# EAGLE design rev6_eagle7 (EAGLE 7.7.0)
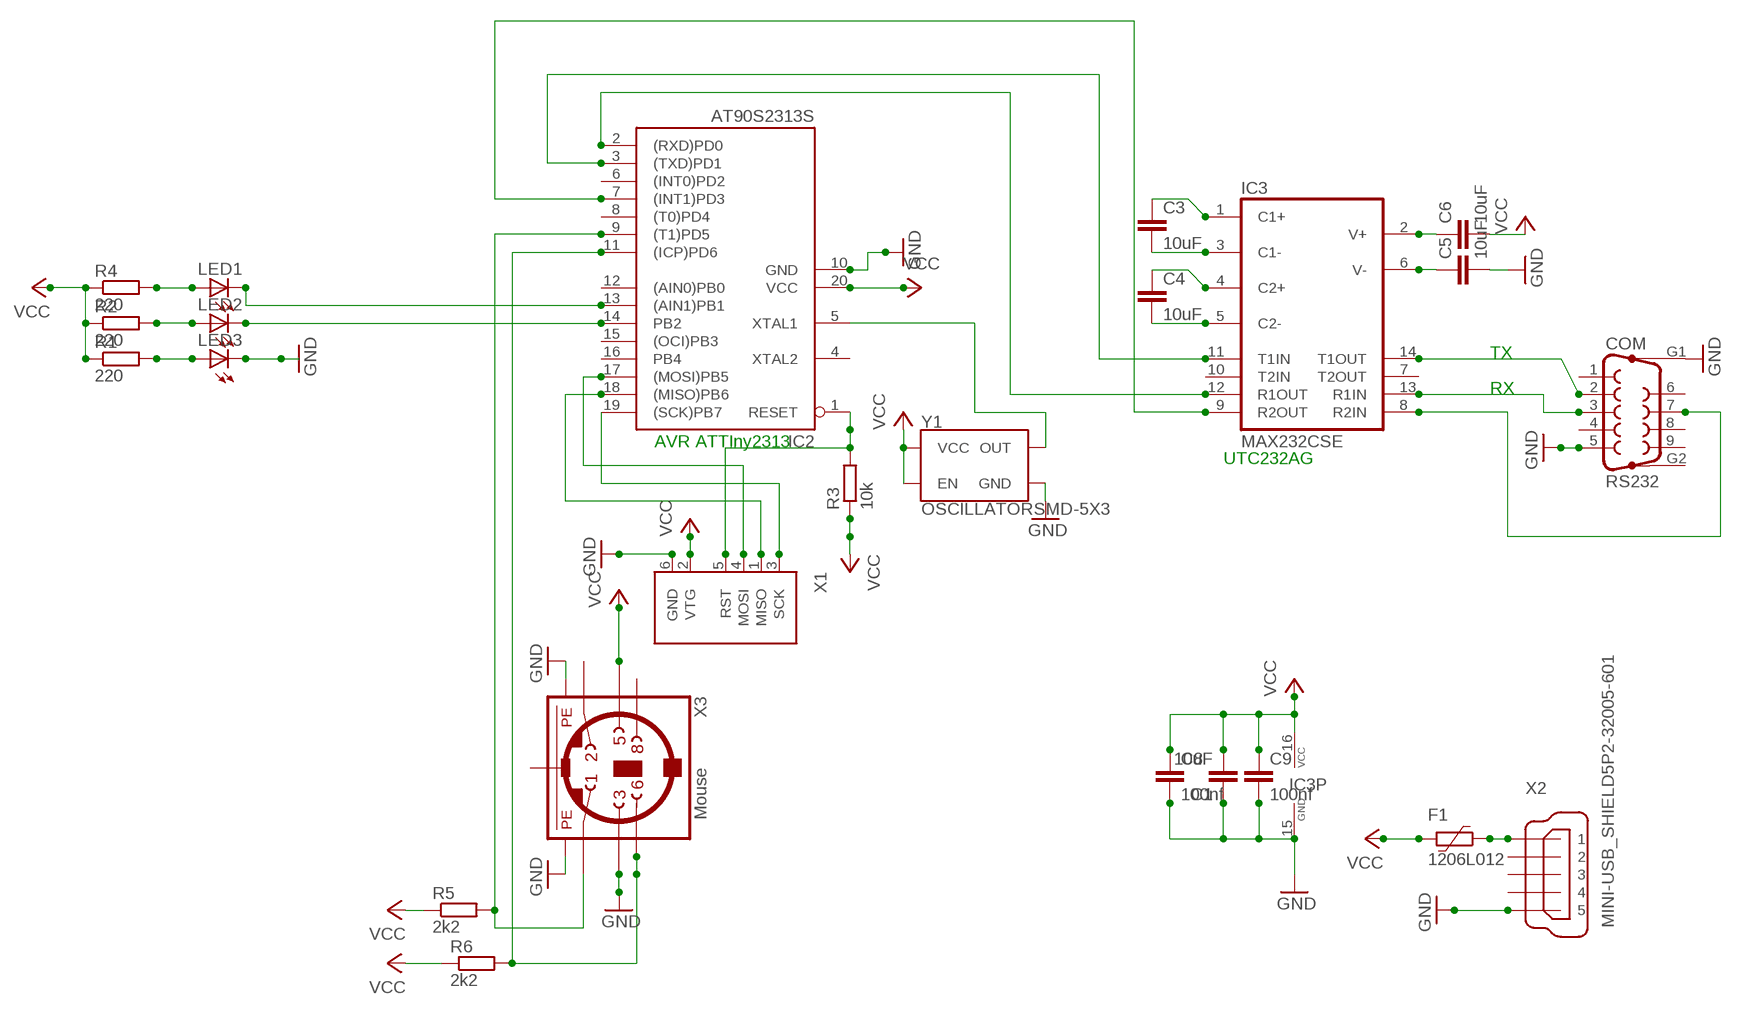
[diagram p0: schematic, sheet 1]

## Parts
C1  10uF  10UF-0805-25V-10%  [0805]
C3  10uF  10UF-0805-25V-10%  [0805]
C4  10uF  10UF-0805-25V-10%  [0805]
C5  10uF  10UF-0805-25V-10%  [0805]
C6  10uF  10UF-0805-25V-10%  [0805]
C8  100nf  C-EUC0805K  [C0805K]
C9  100nf  C-EUC0805K  [C0805K]
COM  RS232  F09HP  [F09HP]
F1  1206L012  [1206L]
IC2  AT90S2313S  [SO20L]
IC3  MAX232CSE  [SO16]
LED1  LEDCHIPLED_0805  [CHIPLED_0805]
LED2  LEDCHIPLED_0805  [CHIPLED_0805]
LED3  LEDCHIPLED_0805  [CHIPLED_0805]
R1  220  R-EU_R0805  [R0805]
R2  220  R-EU_R0805  [R0805]
R3  10k  R-EU_R1206  [R1206]
R4  220  R-EU_R0805  [R0805]
R5  2k2  R-EU_R1206  [R1206]
R6  2k2  R-EU_R1206  [R1206]
X1  AVRISP6PINHEADER  [6PINHEADER]
X2  MINI-USB_SHIELD5P2-32005-601  [32005-601]
X3  Mouse  MINI_DIN_6  [M_DIN6]
Y1  OSCILLATORSMD-5X3  [OSCILLATOR-SMD-5X3.2]

## Nets
GND: C1.1 C5.2 C8.2 C9.2 COM.5 COM.G1 IC2.10(GND) IC3.15(GND) LED3.C X1.6(GND) X2.5 X3.3 X3.SH1(PE1) X3.SH3(PE3) Y1.2(GND)
N$1: IC2.3((TXD)PD1) IC3.11(T1IN)
N$2: IC2.2((RXD)PD0) IC3.12(R1OUT)
N$3: C3.2 IC3.3(C1-)
N$4: C3.1 IC3.1(C1+)
N$5: C4.1 IC3.4(C2+)
N$6: C4.2 IC3.5(C2-)
N$7: IC2.1(RESET) R3.2 X1.5(RST)
N$8: IC2.11((ICP)PD6) R6.2 X3.6
N$9: COM.2 IC3.14(T1OUT)
N$10: LED3.A R1.2
N$11: IC2.7((INT1)PD3) IC3.9(R2OUT)
N$12: IC2.5(XTAL1) Y1.3(OUT)
N$13: IC2.14(PB2) LED2.C
N$14: C5.1 IC3.6(V-)
N$15: C6.1 IC3.2(V+)
N$16: IC2.13((AIN1)PB1) LED1.C
N$17: COM.3 IC3.13(R1IN)
N$20: LED2.A R2.2
N$21: LED1.A R4.2
N$22: IC2.9((T1)PD5) R5.2 X3.1
N$26 [VCC]: F1.1 X2.1
PB5: IC2.17((MOSI)PB5) X1.4(MOSI)
PB6: IC2.18((MISO)PB6) X1.1(MISO)
PB7: IC2.19((SCK)PB7) X1.3(SCK)
SERIAL#: COM.7 IC3.8(R2IN)
VCC [VCC]: C1.2 C6.2 C8.1 C9.1 F1.2 IC2.20(VCC) IC3.16(VCC) R1.1 R2.1 R3.1 R4.1 R5.1 R6.1 X1.2(VTG) X3.5 Y1.1(EN) Y1.4(VCC)
Unconnected: COM.1 COM.4 COM.6 COM.8 COM.9 COM.G2 IC2.4(XTAL2) IC2.6((INT0)PD2) IC2.8((T0)PD4) IC2.12((AIN0)PB0) IC2.15((OCI)PB3) IC2.16(PB4) IC3.7(T2OUT) IC3.10(T2IN) X2.2 X2.3 X2.4 X2.M1(S1) X2.M2(S2) X3.2 X3.8

## Notes on the sheet
- TX
- RX
- AVR ATTIny2313
- UTC232AG

## Power pins joined to a net without a drawn wire
PE2: X3.SH2(PE2)

## Library data of the parts
C1 C3-C6 = SparkFun-Capacitors:10UF: 10.0µF ceramic capacitors A capacitor is a passive two-terminal electrical component used to store electrical energy temporarily in an electric field.; PROD_ID: CAP-14259
C8 C9 = rcl@1:C-EU: CAPACITOR, European symbol; SPICEPREFIX: C
COM = con-subd:F09HP: SUB-D; OC_FARNELL: unknown; OC_NEWARK: unknown
F1 = polyfuse-smd_10:?: Polyfuse Resettable PTC Source: http://www.littelfuse.com/products/resettable-ptcs.aspx; MF: Littelfuse; MPN: 1206L012; OC_FARNELL: 1596988; OC_NEWARK: 05M2298
IC2 = atmel:AT90S2313: MICROCONTROLLER 2 Kbytes FLASH 128 bytes SRAM 128 bytes EEPROM UART; OC_FARNELL: unknown; OC_NEWARK: unknown
IC3 = maxim-8:MAX232*: RS232 TRANSEIVER
LED1-LED3 = led:LED: LED OSRAM: - CHIPLED LG R971, LG N971, LY N971, LG Q971, LY Q971, LO R971, LY R971 LH N974, LH R974 LS Q976, LO Q976, LY Q976 LO Q996 - Hyper CHIPLED LW Q18S LB Q993, LB Q99A, LB R99A - SideLED LS A670, LO A670, LY A670, LG A670, LP A670 LB A673, LV A673, LT A673, LW A673 LH A674 LY A675 LS A676, LA A676, LO A676, LY A676, LW A676 LS A679, LY A679, LG A679 - Hyper Micro SIDELED® LS Y876, LA Y876, LO Y876, LY Y876 LT Y87S - SmartLED LW L88C, LW L88S LB L89C, LB L89S, LG L890 LS L89K, LO L89K, LY L89K LS L896, LA L896, LO L896, LY L896 - TOPLED LS T670, LO T670, LY T670, LG T670, LP T670 LSG T670, LSP T670, LSY T670, LOP T670, LYG T670 LG T671, LOG T671, LSG T671 LB T673, LV T673, LT T673, LW T673 LH T674 LS T676, LA T676, LO T676, LY T676, LB T676, LH T676, LSB T676, LW T676 LB T67C, LV T67C, LT T67C, LS T67K, LO T67K, LY T67K, LW E67C LS E67B, LA E67B, LO E67B, LY E67B, LB E67C, LV E67C, LT E67C LW T67C LS T679, LY T679, LG T679 LS T770, LO T770, LY T770, LG T770, LP T770 LB T773, LV T773, LT T773, LW T773 LH T774 LS E675, LA E675, LY E675, LS T675 LS T776, LA T776, LO T776, LY T776, LB T776 LHGB T686 LT T68C, LB T68C - Hyper Mini TOPLED® LB M676 - Mini TOPLED Santana® LG M470 LS M47K, LO M47K, LY M47K Source: http://www.osram.convergy.de LUXEON: - LUMILED® LXK2-PW12-R00, LXK2-PW12-S00, LXK2-PW14-U00, LXK2-PW14-V00 LXK2-PM12-R00, LXK2-PM12-S00, LXK2-PM14-U00 LXK2-PE12-Q00, LXK2-PE12-R00, LXK2-PE12-S00, LXK2-PE14-T00, LXK2-PE14-U00 LXK2-PB12-K00, LXK2-PB12-L00, LXK2-PB12-M00, LXK2-PB14-N00, LXK2-PB14-P00, LXK2-PB14-Q00 LXK2-PR12-L00, LXK2-PR12-M00, LXK2-PR14-Q00, LXK2-PR14-R00 LXK2-PD12-Q00, LXK2-PD12-R00, LXK2-PD12-S00 LXK2-PH12-R00, LXK2-PH12-S00 LXK2-PL12-P00, LXK2-PL12-Q00, LXK2-PL12-R00 Source: www.luxeon.com KINGBRIGHT: KA-3528ASYC Source: www.kingbright.com
R1 R2 R4 = rcl@1:R-EU_: RESISTOR, European symbol; SPICEPREFIX: R
R3 R5 R6 = rcl:R-EU_: RESISTOR, European symbol
X1 = avrisp:AVRISP6PIN
X2 = con-cypressindustries:MINI-USB_SHIELD5P2-: MINI USB-B R/A DIP 5pol. Source: www.cypressindustries.com; OC_FARNELL: unknown; OC_NEWARK: unknown
X3 = mini_din:MINI_DIN_6
Y1 = SparkFun-Clocks:OSCILLATOR: Oscillators (Generic) These are active oscillators, which require a power source to generate their clock output. Most oscillators are configured to generate a set frequency (e.g. 16MHz). They have four pins: power, ground, output, and an enable input.

## Net classes
1 VCC: width 0.006 mm

## Board
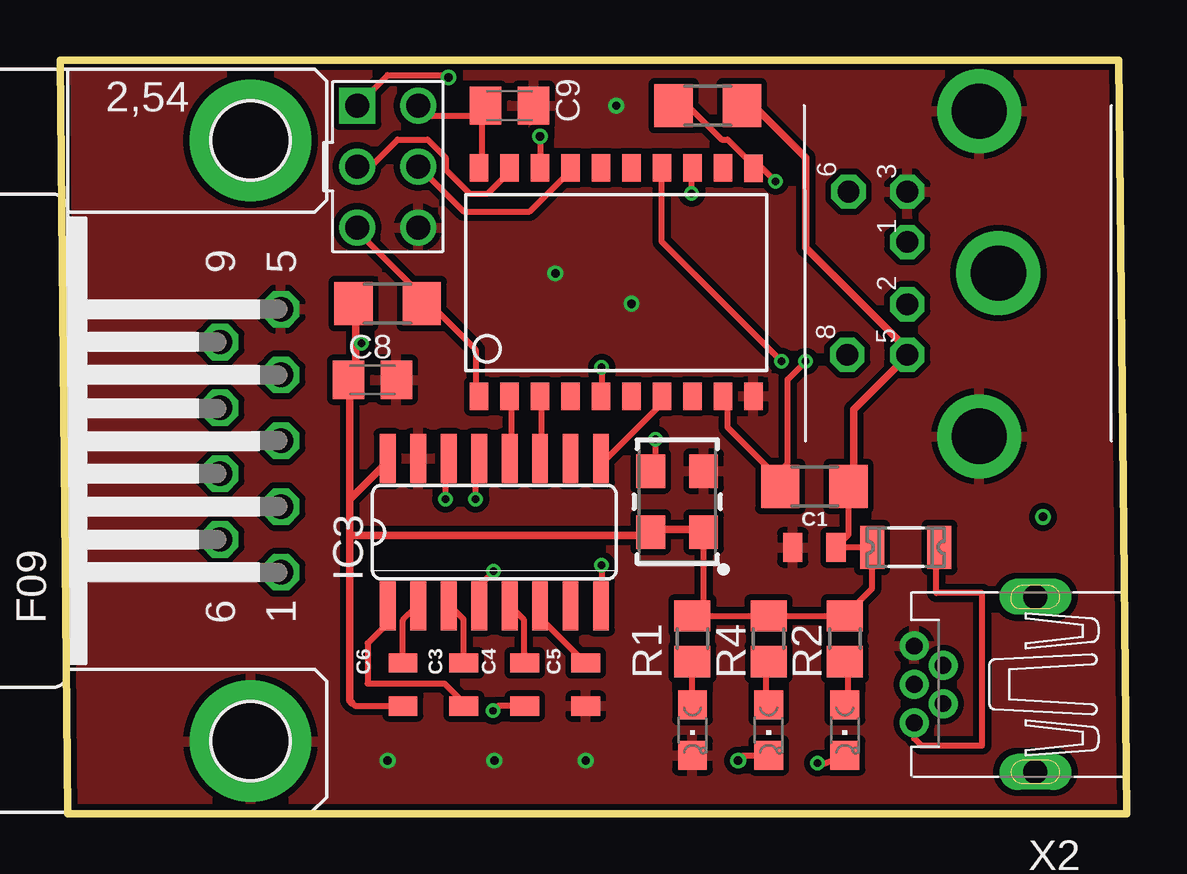
[diagram p1: board, top side]
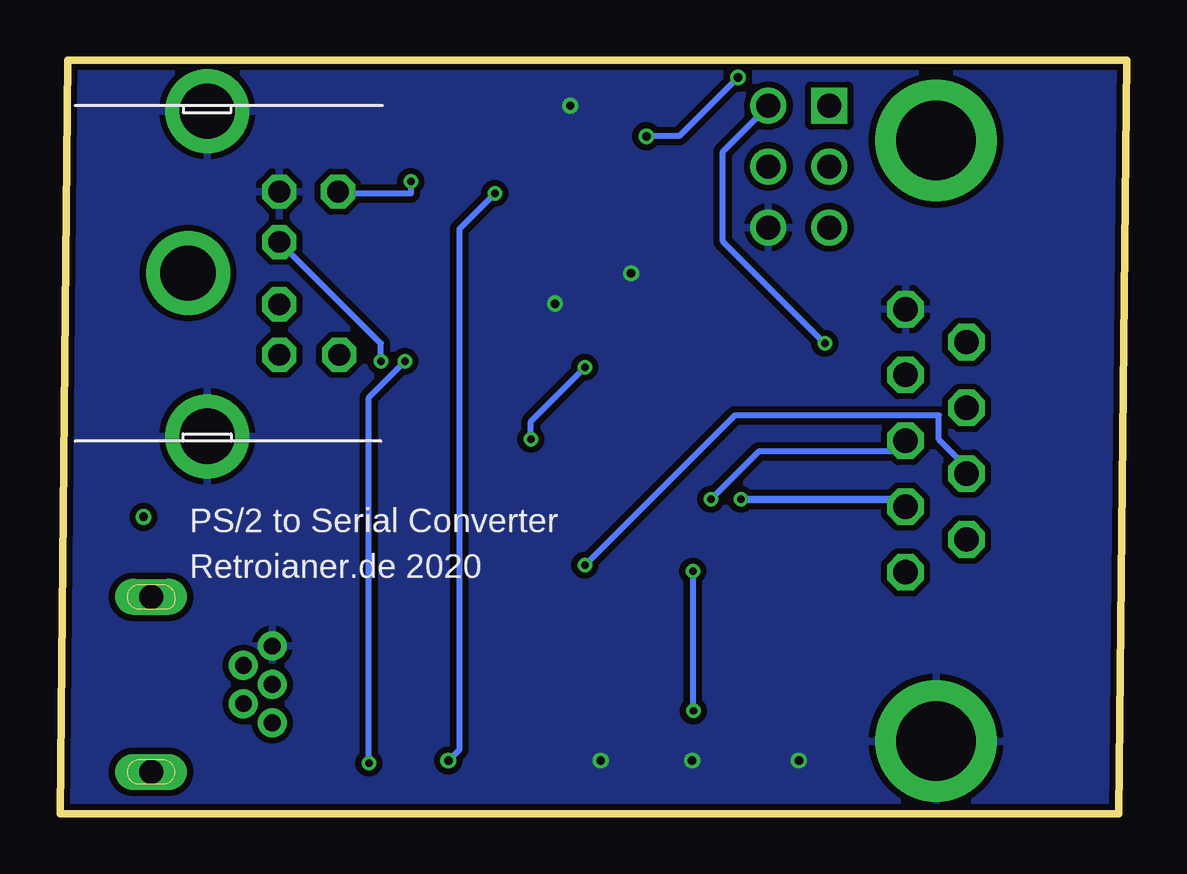
[diagram p2: board, bottom side, seen from below]

Size 44.44 x 31.43 mm. Coordinates in mm from the lower left corner, seen from the top.
Outline: 0.32,0 44.44,0 44.12,31.43 0,31.43 0.32,0
Copper layers (1*16): Top 0.035mm / dielectric 1.5mm / Bottom 0.035mm
Design rules "dirt_cheap_dirty_boards.v1.1 *": minimum track width 10mil, minimum drill 12mil, track to track 6mil, track to pad 6mil, pad to pad 6mil, via to via 6mil, smd to smd 0mil, copper to edge 10mil, drill to drill 10mil, minimum pad ring 10mil, minimum via ring 6mil, stop-mask expansion 2mil, vias tented up to drill 25mil, thermal gap 10mil

### Footprints (pad centres in the part's own frame; a part is rotated, then mirrored left to right if it is on the bottom)
0805 = smd 0.8 x 1.2: 1 -0.9,0; 2 0.9,0
C0805K = smd 1.3 x 1.6: 1 -1,0; 2 1,0
F09HP = drill 1.016 octagon: 1 -5.486,-1.27; 2 -2.743,-1.27; 3 0,-1.27; 4 2.743,-1.27; 5 5.486,-1.27; 6 -4.115,1.27; 7 -1.372,1.27; 8 1.372,1.27; 9 4.115,1.27 | drill 3.302 pad 5.08: G1 -12.522,0; G2 12.522,0
1206L = smd 1 x 1.8: 1 -1.4,0; 2 1.4,0
SO20L = smd 0.762 x 1.143: 1 -5.08,-5.131; 2 -3.81,-5.131; 3 -2.54,-5.131; 4 -1.27,-5.131; 5 0,-5.131; 6 1.27,-5.131; 7 2.54,-5.131; 8 3.81,-5.131; 9 5.08,-5.131; 10 6.35,-5.131; 11 6.35,4.369; 12 5.08,4.394; 13 3.81,4.394; 14 2.54,4.394; 15 1.27,4.394; 16 0,4.394; 17 -1.27,4.394; 18 -2.54,4.394; 19 -3.81,4.394; 20 -5.08,4.394
SO16 = smd 0.66 x 2.032: 1 -4.445,-3.073; 2 -3.175,-3.073; 3 -1.905,-3.073; 4 -0.635,-3.073; 5 0.635,-3.073; 6 1.905,-3.073; 7 3.175,-3.073; 8 4.445,-3.073; 9 4.445,3.073; 10 3.175,3.073; 11 1.905,3.073; 12 0.635,3.073; 13 -0.635,3.073; 14 -1.905,3.073; 15 -3.175,3.073; 16 -4.445,3.073
CHIPLED_0805 = smd 1.2 x 1.2: A 0,-1.05; C 0,1.05
R0805 = smd 1.3 x 1.5: 1 -0.95,0; 2 0.95,0
R1206 = smd 1.6 x 1.803: 1 -1.422,0; 2 1.422,0
6PINHEADER = drill 1 square: 1 -1.27,2.54 | drill 1: 2 1.27,2.54; 3 -1.27,0; 4 1.27,0; 5 -1.27,-2.54; 6 1.27,-2.54
32005-601 = drill 0.7 pad 1.016: 1 2.825,1.6; 2 1.625,0.8; 3 2.825,0; 4 1.625,-0.8; 5 2.825,-1.6 | drill 1 pad 1.422 long: M1 -2.225,3.65; M2 -2.225,-3.65
M_DIN6 = drill 0.9 pad 1.422 octagon: 1 -1.3,-3.75; 2 1.3,-3.75; 3 -3.4,-3.75; 5 3.4,-3.75; 6 -3.4,-6.2; 8 3.4,-6.25 | drill 2.3 pad 3.5: SH1 6.8,-0.75; SH2 0,0.05; SH3 -6.75,-0.75
OSCILLATOR-SMD-5X3.2 = smd 1.397 x 1.194: 1 -1.27,-1.1; 2 1.27,-1.1; 3 1.27,1.1; 4 -1.27,1.1

### Placement (x,y rotation side)
C1  31.43,11.11 0 top
C3  16.83,5.4 90 top
C4  19.37,5.4 90 top
C5  21.91,5.4 270 top
C6  14.29,5.4 270 top
C8  13.02,18.1 0 top
C9  18.73,29.53 0 top
COM  7.94,15.56 90 top
F1  35.24,11.11 180 top
IC2  22.54,22.54 0 top
IC3  18.1,11.75 0 top
LED1  29.53,3.49 180 top
LED2  32.7,3.49 180 top
LED3  26.35,3.49 180 top
R1  26.35,7.3 270 top
R2  32.7,7.3 270 top
R3  13.65,21.27 0 top
R4  29.53,7.3 270 top
R5  31.43,13.65 180 top
R6  26.99,29.53 180 top
X1  13.65,26.99 0 top
X2  38.42,5.4 180 top
X3  39.05,22.54 270 top
Y1  25.72,13.02 90 top

### Tracks (layer width: path | path; a pad name or v marks a point on that pad's centre or on a via)
GND  (via drill 0.35)
  other vias: 13.65,2.22 18.1,2.22 21.91,2.22 20.64,22.54 23.81,21.27 23.18,29.53
  pour Bottom (isolate 0.254): 0.32,31.43 44.13,31.43 44.13,0 0.32,0
  pour Top (isolate 0.254): 0.32,31.43 0.32,0 44.13,0 44.13,31.43
N$1
  Top 0.254: IC2.3 20.07,17.37 20.07,14.87 IC3.11
N$2
  Top 0.254: IC2.2 18.82,17.37 18.82,14.87 IC3.12
N$3
  Top 0.254: IC3.3 16.32,8.62 16.82,8.12 C3.2
N$4
  Top 0.254: IC3.1 13.57,8.62 13.57,7.87 12.82,7.12 12.82,5.43 16.02,5.43 16.6,4.85 16.6,4.72 C3.1
N$5  (via drill 0.3)
  Top 0.254: v18.07,10.12 17.57,9.62 17.57,8.87 IC3.4 | C4.1 18.24,4.5 v18.05,4.3
  Bottom 0.254: v18.05,4.3 18.07,4.32 v18.07,10.12
N$6
  Top 0.254: IC3.5 18.82,8.62 19.32,8.12 19.32,6.67 19.37,6.67 C4.2
N$7
  Top 0.254: 15.32,21.37 17.32,19.37 17.32,17.62 IC2.1 | 15.32,21.37 12.57,24.12 12.57,24.37 X1.5 | 15.32,21.37 R3.2
N$8  (via drill 0.3)
  Top 0.254: R6.2 25.57,29.37 26.32,29.37 27.57,28.12 27.82,28.12 28.82,27.12 IC2.11 29.07,27.12 v29.82,26.37
  Bottom 0.254: v29.82,26.37 29.82,25.87 32.82,25.87 X3.6
N$9  (via drill 0.3)
  Top 0.254: v16.07,13.12 16.07,14.62 IC3.14
  Bottom 0.254: 9.32,13.12 9.32,12.87 COM.2
  Bottom 0.305: 9.32,13.12 v16.07,13.12
N$10
  Top 0.254: LED3.A R1.2
N$11
  Top 0.254: IC2.7 25.07,17.37 25.07,17.12 22.57,14.62 IC3.9
N$12  (via drill 0.3)
  Top 0.254: v22.57,18.62 22.57,17.62 IC2.5 | v24.82,15.62 24.82,14.37 Y1.3
  Bottom 0.254: v22.57,18.62 24.82,16.37 v24.82,15.62
N$13  (via drill 0.3)
  Top 0.254: v30.07,18.87 25.07,23.87 25.07,26.87 IC2.14 | v31.57,2.12 31.67,2.02 LED2.C
  Bottom 0.254: v30.07,18.87 31.57,17.37 v31.57,2.12
N$14
  Top 0.254: IC3.6 20.07,8.62 20.07,8.12 21.82,6.37 21.84,6.37 C5.1
N$15
  Top 0.254: IC3.2 14.82,8.62 14.29,8.09 C6.1
N$16  (via drill 0.3, 0.35)
  Top 0.254: v26.32,25.87 26.32,26.87 IC2.13 | v28.26,2.22 28.48,2.44 LED1.C
  Bottom 0.254: v26.32,25.87 27.8,24.39 27.8,2.68 v28.26,2.22
N$17  (via drill 0.3)
  Top 0.254: v17.32,13.12 17.32,14.62 IC3.13
  Bottom 0.254: v17.32,13.12 15.32,15.12 9.32,15.12 9.32,15.37 COM.3
N$20
  Top 0.254: LED2.A 32.82,4.64 32.82,6.24 R2.2
N$21
  Top 0.254: LED1.A 29.43,4.64 29.43,6.26 R4.2
N$22  (via drill 0.3)
  Top 0.254: 29.82,14.12 30.07,13.87 R5.2 29.82,14.12 | 29.82,14.12 27.82,16.12 27.82,17.37 IC2.9 | v31.07,18.87 30.32,18.12 30.32,14.62 29.82,14.12
  Bottom 0.254: v31.07,18.87 31.07,19.62 35.07,23.62 X3.1
N$26
  Top 0.254: X2.1 35.59,3.14 35.88,2.86 38.42,2.86 38.42,9.21 36.51,9.21 36.51,10.98 F1.1
N$27  (via drill 0.35)
  other vias: 40.96,12.38
PB5
  Top 0.254: IC2.17 21.07,26.87 21.07,26.62 19.57,25.12 16.82,25.12 15.07,26.87 X1.4
PB6  (via drill 0.35)
  Top 0.254: X1.1 13.65,30.8 16.09,30.8 v16.19,30.7 | v20,28.25 IC2.18
  Bottom 0.254: v16.19,30.7 18.63,28.26 v20,28.26 v20,28.25
PB7
  Top 0.254: IC2.19 18.57,26.87 18.57,26.62 17.82,25.87 17.07,25.87 16.07,26.87 16.07,27.37 15.32,28.12 14.07,28.12 13.07,27.12 12.57,27.12 X1.3
SERIAL#  (via drill 0.3)
  Top 0.254: v22.57,10.37 22.57,8.87 IC3.8
  Bottom 0.254: v22.57,10.37 16.32,16.62 7.82,16.62 7.82,15.62 6.82,14.62 6.82,14.37 COM.7
VCC  (via drill 0.3)
  Top 0.254: 17.57,29.12 17.57,27.12 IC2.20 | 17.57,29.12 15.32,29.12 15.07,29.37 X1.2 | 12.32,21.12 R3.1 | 13.57,14.62 IC3.16 | 12.32,19.62 v12.57,19.62 | 24.82,11.87 Y1.4 24.57,11.62 | 26.82,11.87 Y1.1 26.82,8.72 R1.1 R4.1 R2.1 33.84,9.39 F1.2 C1.2 32.85,11.63 R5.1 33.07,13.87 | 29.07,29.37 28.57,29.37 R6.1 | 35.32,19.12 X3.5 | 12.16,4.64 12.3,4.5 C6.2 | 12.32,18.41 12.32,18.4 C8.1 12.07,18.05 12.07,17.87 | C9.1 17.73,29.28 17.57,29.12
  Top 0.305: 12.32,21.12 12.32,19.62 12.32,18.41 | 12.16,4.64 12.07,4.73 12.07,11.62 | 12.07,13.12 12.07,11.62 | 13.57,14.62 12.07,13.12 | 12.07,17.87 12.07,13.12 | 26.82,11.87 24.82,11.87 | 29.07,29.37 31.07,27.37 31.07,23.62 35.32,19.37 X3.5 | 33.07,13.87 33.07,16.87 35.32,19.12 | 24.57,11.62 12.07,11.62
  Bottom 0.254: v12.57,19.62 16.82,23.87 16.82,27.62 15.07,29.37 X1.2

### Text on the board
bNames: PS/2 to Serial Converter | Retroianer.de 2020